# EasyEDA Pro project EasyEDApro.epro

# Schematic IR remote esp32
Create Date: 2024-05-21; Page Name: P1; Project Name: ROBONOMICS IR REMOTE DEV RELEASE; Schematic Name: ESP32-WROOM-32UE-N8; Update Date: 2024-05-21; Company: Robonomics.network; Drawn: ludovich88; Page Size: A4; Part Number: IR-ESP32-32UE; Reviewed: EnsRationis; Version: V2.1
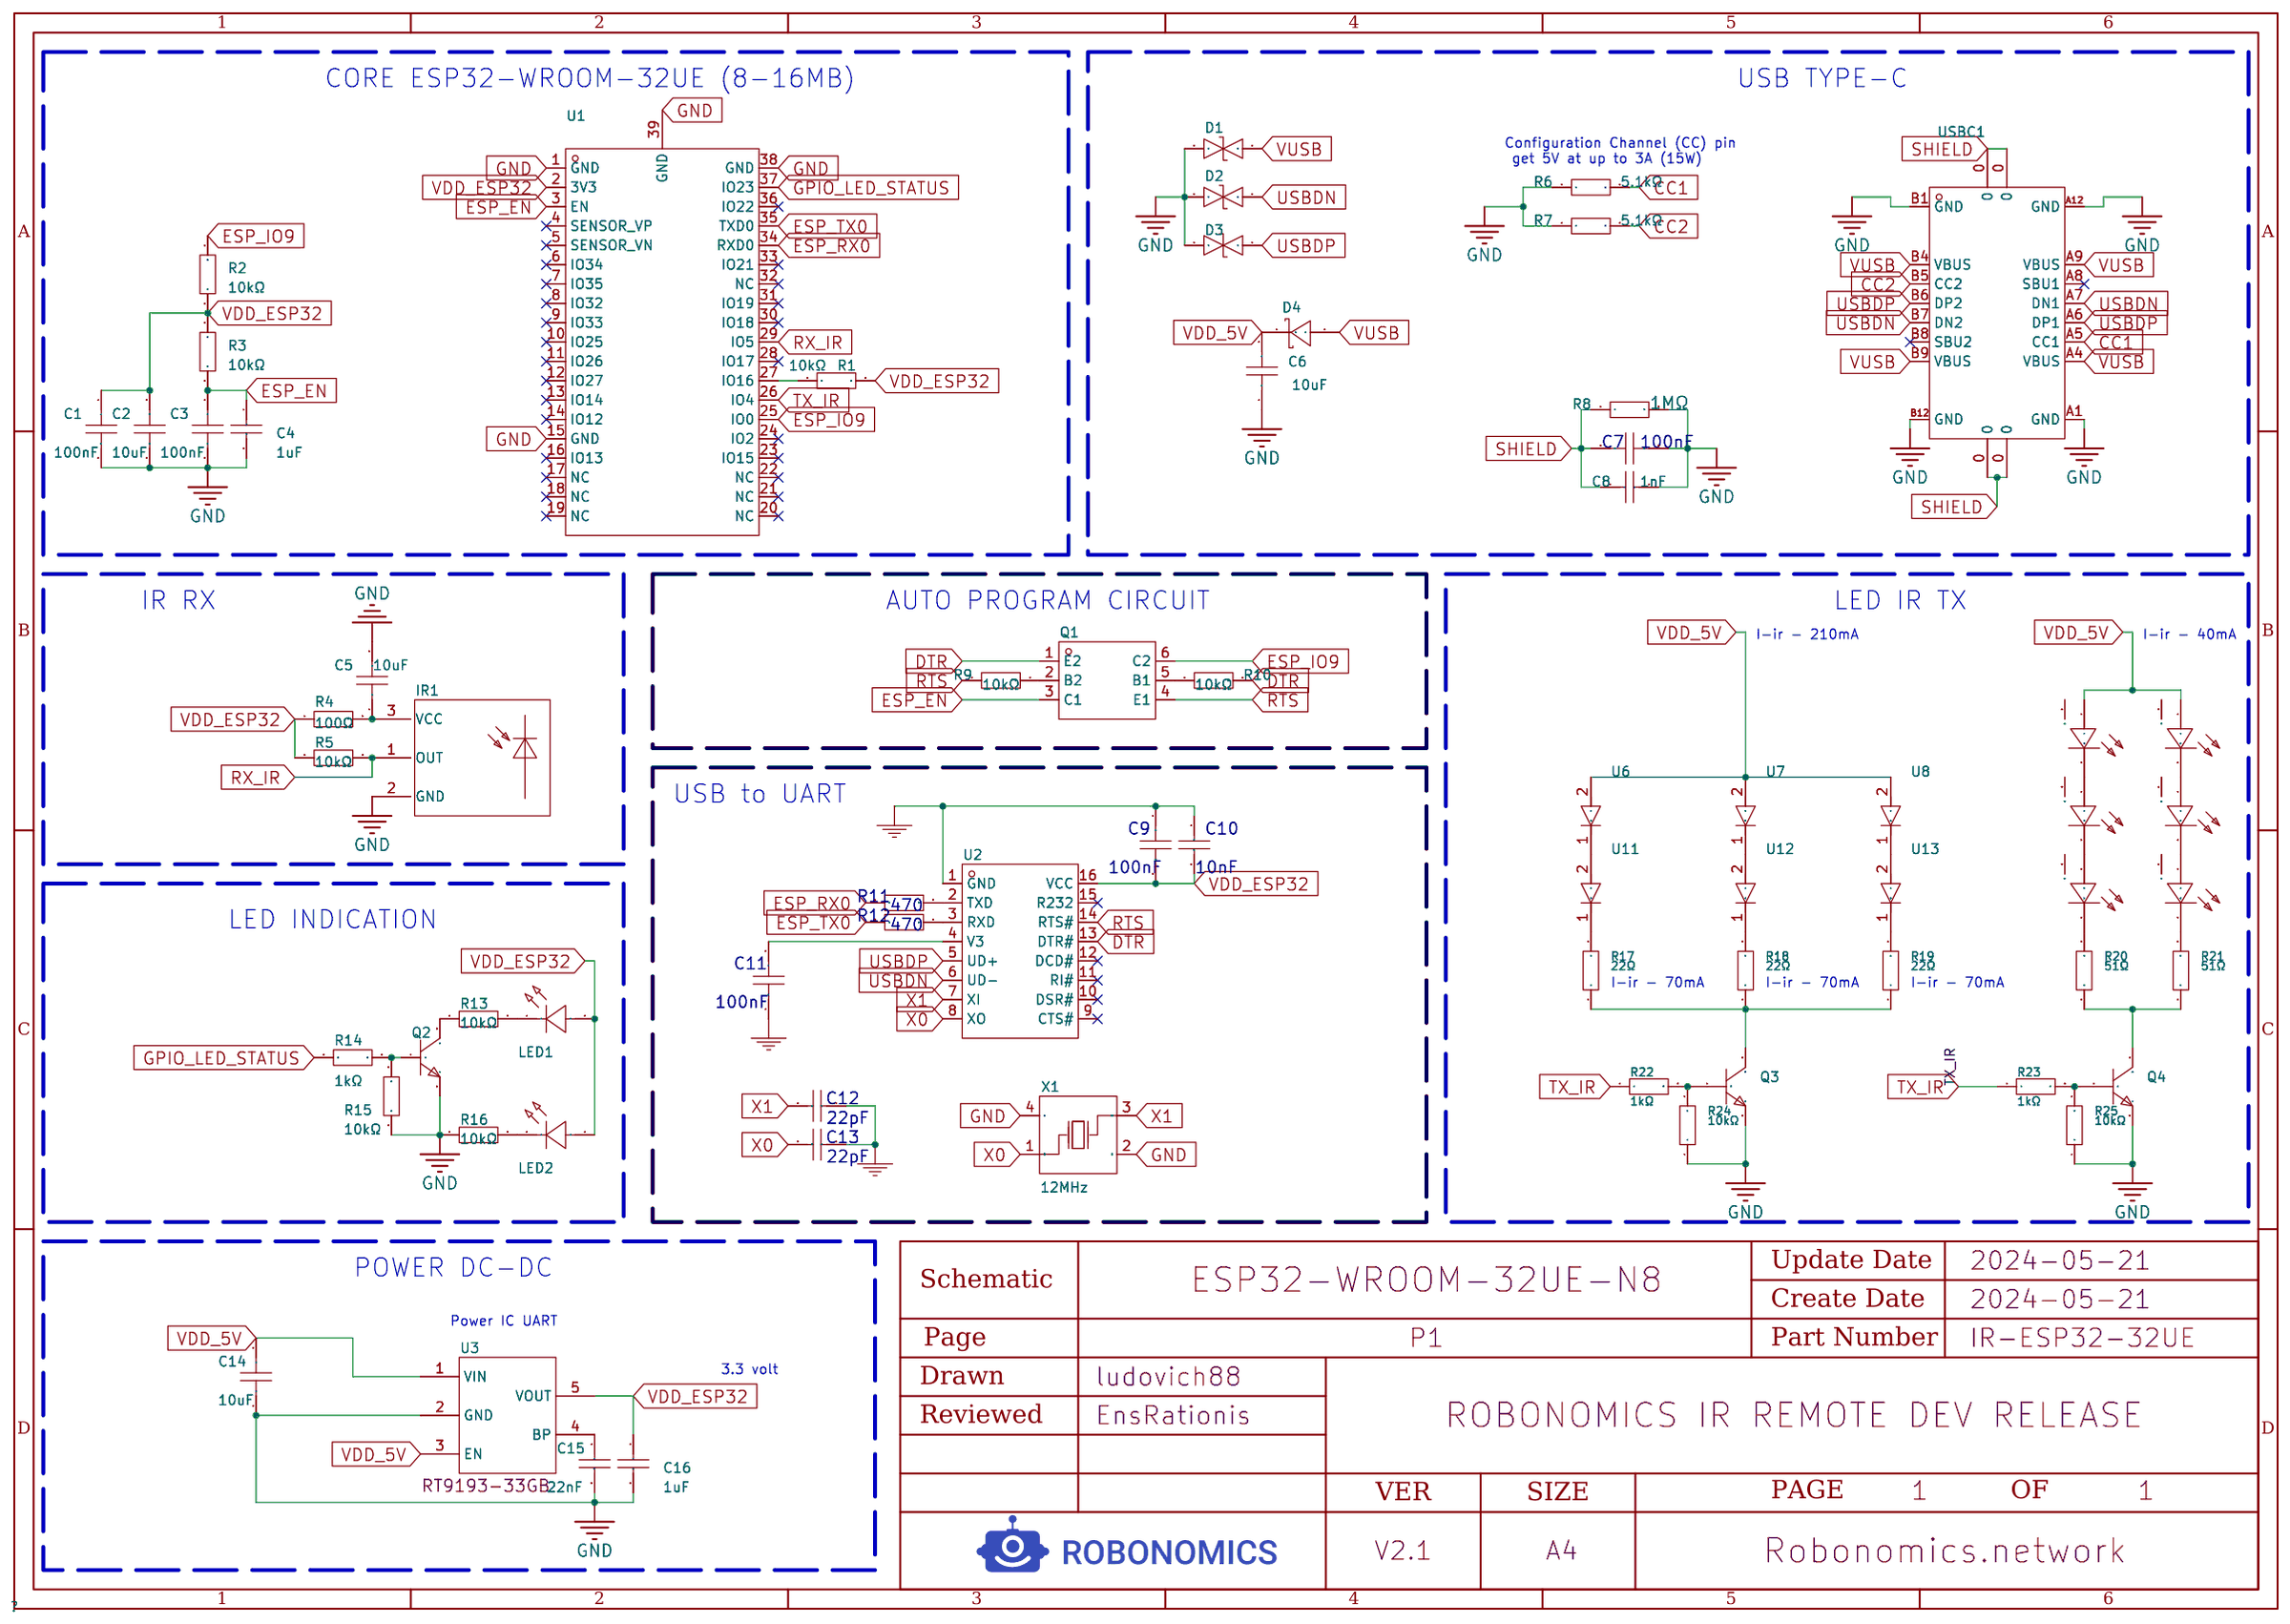
[diagram p0: schematic sheet]

## Parts
C1  100nF  [C0603]
C2  10uF  [C0603]
C3  100nF  [C0603]
C4  1uF  [C0603]
C5  10uF  [C0603]
C6  10uF  [C0603]
C7  100nF  [C0603]
C8  1nF  [C0603]
C9  100nF  [C0603]
C10  10nF  [C0603]
C11  100nF  [C0603]
C12  22pF  [C0603]
C13  22pF  [C0603]
C14  10uF  [C0603]
C15  22nF  [C0603]
C16  1uF  [C0603]
D1  -  [SOD-523_L1.2-W0.8-LS1.6-BI]
D2  -  [SOD-523_L1.2-W0.8-LS1.6-BI]
D3  -  [SOD-523_L1.2-W0.8-LS1.6-BI]
D4  -  [SOD-123_L2.7-W1.6-LS3.7-RD]
IR1  -  [OPTO-TH_IRM-56384]
LED1  XL-4008UGC  [LED-SMD_L4.0-W1.4-RD_GREEN]
LED2  XL-4008SURC  [LED-SMD_L4.0-W1.4-FD_my]
Q1  -  [SOT-363_L2.0-W1.3-P0.65-LS2.1-BR]
Q2  SS8050  [SOT-23-3_L2.9-W1.6-P1.90-LS2.8-BR]
Q3  -  [SOT-23-3_L2.9-W1.6-P1.90-LS2.8-BR]
Q4  -  [SOT-23-3_L2.9-W1.6-P1.90-LS2.8-BR]
R1  10kΩ  [R0603]
R2  10kΩ  [R0603]
R3  10kΩ  [R0603]
R4  100Ω  [R0603]
R5  10kΩ  [R0603]
R6  5.1kΩ  [R0603]
R7  5.1kΩ  [R0603]
R8  1MΩ  [R0603]
R9  10kΩ  [R0603]
R10  10kΩ  [R0603]
R11  470Ω  [R0603]
R12  470Ω  [R0603]
R13  10kΩ  [R0603]
R14  1kΩ  [R0603]
R15  10kΩ  [R0603]
R16  10kΩ  [R0603]
R17  22Ω  [R0603]
R18  22Ω  [R0603]
R19  22Ω  [R0603]
R20  51Ω  [R0603]
R21  51Ω  [R0603]
R22  1kΩ  [R0603]
R23  1kΩ  [R0603]
R24  10kΩ  [R0603]
R25  10kΩ  [R0603]
U1  -  [WIFI-SMD_ESP32-WROOM-32UE]
U2  -  [SOIC-16_L9.9-W3.9-P1.27-LS6.0-BL]
U3  -  [SOT-23-5_L3.0-W1.7-P0.95-LS2.8-BR]
U4  LKIR30102C-A01(XY)  [LED-SMD_EVERLIGHT_LKIR30102C-A01XY]
U5  LKIR30102C-A01(XY)  [LED-SMD_EVERLIGHT_LKIR30102C-A01XY]
U6  SFH 4253-Z  [OPTO-SMD_L3.2-W2.8-LS3.5-L-1]
U7  SFH 4253-Z  [OPTO-SMD_L3.2-W2.8-LS3.5-L-1]
U8  SFH 4253-Z  [OPTO-SMD_L3.2-W2.8-LS3.5-L-1]
U9  LKIR30102C-A01(XY)  [LED-SMD_EVERLIGHT_LKIR30102C-A01XY]
U10  LKIR30102C-A01(XY)  [LED-SMD_EVERLIGHT_LKIR30102C-A01XY]
U11  SFH 4253-Z  [OPTO-SMD_L3.2-W2.8-LS3.5-L-1]
U12  SFH 4253-Z  [OPTO-SMD_L3.2-W2.8-LS3.5-L-1]
U13  SFH 4253-Z  [OPTO-SMD_L3.2-W2.8-LS3.5-L-1]
U14  LKIR30102C-A01(XY)  [LED-SMD_EVERLIGHT_LKIR30102C-A01XY]
U15  LKIR30102C-A01(XY)  [LED-SMD_EVERLIGHT_LKIR30102C-A01XY]
USBC1  -  [USB-C_SMD-TYPE-C-31-M-12]
X1  12MHz  [OSC-SMD_4P-L3.2-W2.5-BL]

## Library data of the parts
C1 C3 = CC0603KRX7R9BB104: Capacitance: Tolerance:±10% Tolerance:±10% Voltage Rated: Temperature Coefficient:; LCSC Part Name: 100nF ±10% 50V; Supplier Part: C14663; Manufacturer: YAGEO(国巨); Supplier Footprint: 0603; JLCPCB Part Class: Basic Part; Datasheet: https://atta.szlcsc.com/upload/public/pdf/source/20180910/C282072_33301C7F631E79921B82A8DAC6BCC5B3.pdf; Supplier: LCSC; Tolerance: ±10%; Voltage Rated: 50V; Temperature Coefficient: Y5V
C2 C5 C14 = CL10A106KP8NNNC: Capacitance: Tolerance:±10% Tolerance:±10% Voltage Rated: Temperature Coefficient:; LCSC Part Name: 10uF ±10% 10V; Supplier Part: C19702; Manufacturer: SAMSUNG(三星); Supplier Footprint: 0603; JLCPCB Part Class: Basic Part; Datasheet: https://atta.szlcsc.com/upload/public/pdf/source/20160218/1457707763339.pdf; Supplier: LCSC; Tolerance: ±10%; Voltage Rated: 10V; Temperature Coefficient: X5R
C4 C16 = CL10A105KB8NNNC: Capacitance:1uFTolerance:±10%Tolerance:±10%VoltageRated:50VTemperatureCoefficient:X5R; LCSC Part Name: 1uF±10%50V; Supplier Part: C15849; Manufacturer: SAMSUNG(三星); Supplier Footprint: 0603; JLCPCB Part Class: BasicPart; Datasheet: https://atta.szlcsc.com/upload/public/pdf/source/20160103/1457707679084.pdf; Supplier: LCSC; Tolerance: ±10%; Voltage Rated: 50V; Temperature Coefficient: X5R
C6 = CL10A106KP8NNNC: Capacitance: Tolerance:±10% Tolerance:±10% Voltage Rated: Temperature Coefficient:; LCSC Part Name: 10uF ±10% 10V; Supplier Part: C19702; Manufacturer: SAMSUNG(三星); Supplier Footprint: 0603; JLCPCB Part Class: Basic Part; Datasheet: https://atta.szlcsc.com/upload/public/pdf/source/20160218/1457707763339.pdf; Supplier: LCSC; Tolerance: ±10%
C7 C9 C11 = CC0603KRX7R9BB104: Capacitance: Tolerance:±10% Tolerance:±10% Voltage Rated: Temperature Coefficient:; LCSC Part Name: 100nF ±10% 50V; Supplier Part: C14663; Manufacturer: YAGEO(国巨); Supplier Footprint: 0603; JLCPCB Part Class: Basic Part; Datasheet: https://atta.szlcsc.com/upload/public/pdf/source/20180910/C282072_33301C7F631E79921B82A8DAC6BCC5B3.pdf; Supplier: LCSC; Tolerance: ±10%
C8 = CL10B102KB8NNNC: Capacitance:1nFTolerance:±10%Tolerance:±10%VoltageRated:50VTemperatureCoefficient:X7R; LCSC Part Name: 1nF±10%50V; Supplier Part: C1588; Manufacturer: SAMSUNG(三星); Supplier Footprint: 0603; JLCPCB Part Class: BasicPart; Datasheet: https://atta.szlcsc.com/upload/public/pdf/source/20160103/1457707679526.pdf; Supplier: LCSC; Tolerance: ±10%; Voltage Rated: 50V; Temperature Coefficient: X7R
C10 = 0603B103K500NT: Supplier: LCSC; Manufacturer: FH; Supplier Part: C57112; JLCPCB Part Class: BasicPart
C12 C13 = CL10C220JB8NNNC: Supplier: LCSC; Manufacturer: SAMSUNG; Supplier Part: C1653; JLCPCB Part Class: BasicPart
C15 = CL10B223KB8NNNC: Capacitance:22nFTolerance:±10%Tolerance:±10%VoltageRated:50VTemperatureCoefficient:X7R; LCSC Part Name: 22nF±10%50V; Supplier Part: C21122; Manufacturer: SAMSUNG(三星); Supplier Footprint: 0603; JLCPCB Part Class: BasicPart; Datasheet: https://atta.szlcsc.com/upload/public/pdf/source/20160103/1457707705232.pdf; Supplier: LCSC; Tolerance: ±10%; Voltage Rated: 50V; Temperature Coefficient: X7R
D1-D3 = LESD5D5.0CT1G: Polarity:Bi-DirectionalReverseStand-OffVoltage(Vrwm):5VBreakdownVoltage(VBR):5.6VPeakPulseCurrent(Ipp)@8/20us:9.4AClampingVoltage@Ipp:18.6V; Supplier Part: C383211; Manufacturer: LRC(乐山无线电); Supplier Footprint: SOD-523; JLCPCB Part Class: ExtendedPart; Datasheet: https://atta.szlcsc.com/upload/public/pdf/source/20190807/C383211_633DF4B4E2C161403226E5235FE33A1C.pdf; Supplier: LCSC; Polarity: Bi-Directional; Reverse Stand-Off Voltage (Vrwm): 5V; Breakdown Voltage (VBR): 5.6V; Peak Pulse Current(Ipp)@8/20us: 9.4A; Clamping Voltage@Ipp: 18.6V
D4 = 1N5819HW-7-F: ReverseVoltage(Vr):40VAverageRectifiedCurrent(Io):1AForwardVoltage(Vf@If):450mV@1A; LCSC Part Name: 40V1A450mV@1A; Supplier Part: C82544; Manufacturer: DIODES(美台); Supplier Footprint: SOD-123; JLCPCB Part Class: ExtendedPart; Datasheet: https://atta.szlcsc.com/upload/public/pdf/source/20161024/1477288459223.pdf; Supplier: LCSC; Reverse Voltage (Vr): 40V; Average Rectified Current (Io): 1A; Forward Voltage (Vf@If): 450mV@1A
IR1 = IRM-56384: Supplier Part: C72048; Manufacturer: EVERLIGHT(亿光); Supplier Footprint: SIP-3-2.54mm; Datasheet: https://atta.szlcsc.com/upload/public/pdf/source/20160507/1462613614000.pdf; Supplier: LCSC
LED1 = XL-4008UGC: EmittedColor:EmeraldLensColor:ColorlesstransparenceDominantWavelength:520nm~525nmDominantWavelength:520nm~525nmPeakWavelength:525nmForwardCurrent:50mAPowerDissipation:125mWViewingAngle:120°MountingSytle:SidestickersOperatingTemperatur; LCSC Part Name: 侧贴; Supplier Part: C2843772; Manufacturer: XINGLIGHT(成兴光); Supplier Footprint: SMD,1.4x4mm; JLCPCB Part Class: ExtendedPart; Datasheet: https://atta.szlcsc.com/upload/public/pdf/source/20221102/5120FC94C7C2123DB0544AD5FB85956A.pdf; Supplier: LCSC; Emitted Color: Emerald; Lens Color: Colorlesstransparence; Dominant Wavelength: 520nm~525nm; Peak Wavelength: 525nm; Forward Current: 50mA; Power Dissipation: 125mW; Viewing Angle: 120°; Mounting Sytle: Sidestickers; Operating Temperature: -30℃~+85℃
LED2 = XL-4008SURC: EmittedColor:红灯LensColor:ColorlesstransparenceDominantWavelength:620nm~625nmDominantWavelength:620nm~625nmPeakWavelength:625nmForwardCurrent:50mAPowerDissipation:125mWViewingAngle:120°MountingSytle:SidestickersOperatingTemperature:-30; LCSC Part Name: 红灯侧贴; Supplier Part: C2843771; Manufacturer: XINGLIGHT(成兴光); Supplier Footprint: SMD,1.4x4mm; JLCPCB Part Class: ExtendedPart; Datasheet: https://atta.szlcsc.com/upload/public/pdf/source/20221102/EAC0B38F8924C881A99BE374D0B10640.pdf; Supplier: LCSC; Emitted Color: 红灯; Lens Color: Colorlesstransparence; Dominant Wavelength: 620nm~625nm; Peak Wavelength: 625nm; Forward Current: 50mA; Power Dissipation: 125mW; Viewing Angle: 120°; Mounting Sytle: Sidestickers; Operating Temperature: -30℃~+85℃
Q1 = LBC847BDW1T1G: TransistorType:2NPNCollector-EmitterBreakdownVoltage(Vceo):CollectorCurrent(Ic):PowerDissipation(Pd):CollectorCut-OffCurrent(Icbo):15nACollector-EmitterSaturationVoltage(VCE(sat)@Ic,Ib):600mV@100mA,5mADCCurrentGain(hFE@Ic,Vce):180@; LCSC Part Name: 2个NPN45V100mA; Supplier Part: C383191; Manufacturer: LRC(乐山无线电); Supplier Footprint: SC-88; Datasheet: https://atta.szlcsc.com/upload/public/pdf/source/20190725/C383191_905ABB7983ACCB470816CB967A06AF18.pdf; Supplier: LCSC; Transistor Type: 2NPN; Collector Cut-Off Current (Icbo): 15nA; Collector-Emitter Saturation Voltage (VCE(sat)@Ic,Ib): 600mV@100mA,5mA; DC Current Gain (hFE@Ic,Vce): 180@2mA,5V; Transition Frequency (fT): 100MHz; Operating Temperature: -55℃~+150℃@(Tj)
Q2 = SS8050_C181160: TransistorType:Collector-EmitterBreakdownVoltage(Vceo):CollectorCurrent(Ic):PowerDissipation(Pd):CollectorCut-OffCurrent(Icbo):100nACollector-EmitterSaturationVoltage(VCE(sat)@Ic,Ib):500mV@800mA,80mADCCurrentGain(hFE@Ic,Vce):200@100; LCSC Part Name: NPN25V1.5AH档（200-350）; Supplier Part: C181160; Manufacturer: Hottech(合科泰); Supplier Footprint: SOT-23; JLCPCB Part Class: ExtendedPart; Datasheet: https://atta.szlcsc.com/upload/public/pdf/source/20220506/87BBA77FEE9CB4B19031AE933C67329E.pdf; Supplier: LCSC; Collector Cut-Off Current (Icbo): 100nA; Collector-Emitter Saturation Voltage (VCE(sat)@Ic,Ib): 500mV@800mA,80mA; DC Current Gain (hFE@Ic,Vce): 200@100mA,1V; Transition Frequency (fT): 100MHz; Operating Temperature: +150℃@(Tj)
Q3 Q4 = SS8050_C177739: TransistorType:Collector-EmitterBreakdownVoltage(Vceo):CollectorCurrent(Ic):PowerDissipation(Pd):CollectorCut-OffCurrent(Icbo):100nACollector-EmitterSaturationVoltage(VCE(sat)@Ic,Ib):500mV@800mA,80mADCCurrentGain(hFE@Ic,Vce):300@100; LCSC Part Name: NPN25V1.5AJ档300-400; Supplier Part: C177739; Manufacturer: CJ(江苏长电/长晶); Manufacturer Part: SS8050; Supplier Footprint: SOT-23; Datasheet: https://atta.szlcsc.com/upload/public/pdf/source/20180130/C177739_15172974524031323483.pdf; Supplier: LCSC; Collector Cut-Off Current (Icbo): 100nA; Collector-Emitter Saturation Voltage (VCE(sat)@Ic,Ib): 500mV@800mA,80mA; DC Current Gain (hFE@Ic,Vce): 300@100mA,1V; Transition Frequency (fT): 100MHz; Operating Temperature: +150℃@(Tj)
R1-R3 R5 R9 R10 R13 R15 R16 = 0603WAF1002T5E: Type:Thick Film Resistors Resistance:10000Ω Tolerance:±1% Tolerance:±1% Power(Watts): Overload Voltage (Max): Temperature Coefficient:±100ppm/℃ Temperature Coefficient:±100ppm/℃ Operating Temperature Range:-55℃~+155℃ Operating Temperature Range:-55℃~+155℃; LCSC Part Name: 10kΩ ±1% 100mW 厚膜电阻; Supplier Part: C25804; Manufacturer: UNI-ROYAL(厚声); Supplier Footprint: 0603; JLCPCB Part Class: Basic Part; Datasheet: https://atta.szlcsc.com/upload/public/pdf/source/20200306/C422600_1E6D84923E4A46A82E41ADD87F860B5C.pdf; Supplier: LCSC; Tolerance: ±1%; Power(Watts): 1/10W; Overload Voltage (Max): 75V; Temperature Coefficient: ±100ppm/℃; Type: Thick Film Resistors; Operating Temperature Range: -55℃~+155℃
R4 = 0603WAF1000T5E: Type:ThickFilmResistorsResistance:Tolerance:±1%Tolerance:±1%Power(Watts):TemperatureCoefficient:±200ppm/℃TemperatureCoefficient:±200ppm/℃OverloadVoltage(Max):OperatingTemperatureRange:-55℃~+155℃OperatingTemperatureRange:-55℃~+155℃; LCSC Part Name: 100Ω±1%100mW; Supplier Part: C22775; Manufacturer: UNI-ROYAL(厚声); Supplier Footprint: 0603; JLCPCB Part Class: BasicPart; Datasheet: https://atta.szlcsc.com/upload/public/pdf/source/20200306/C422600_1E6D84923E4A46A82E41ADD87F860B5C.pdf; Supplier: LCSC; Type: ThickFilmResistors; Tolerance: ±1%; Temperature Coefficient: ±200ppm/℃; Operating Temperature Range: -55℃~+155℃
R6 R7 = 0603WAF5101T5E: Type:厚膜电阻 Resistance:5.1kΩ Tolerance:±1% Power(Watts):1/10W Temperature Coefficient:±100ppm/ Temperature Coefficient:±100ppm/ Overload Voltage (Max):75V Operating Temperature Range:-55~+155 Operating Temperature Range:-55~+155; LCSC Part Name: 5.1kΩ±1%; Supplier Part: C23186; Manufacturer: UNI-ROYAL(厚声); Supplier Footprint: 0603; JLCPCB Part Class: BasicPart; Datasheet: https://atta.szlcsc.com/upload/public/pdf/source/20200306/C422600_1E6D84923E4A46A82E41ADD87F860B5C.pdf; Supplier: LCSC; Type: 厚膜电阻; Tolerance: ±1%; Power(Watts): 1/10W; Temperature Coefficient: ±100ppm/; Overload Voltage (Max): 75V; Operating Temperature Range: -55~+155
R8 = 0603WAF1004T5E: LCSC Part Name: 1MΩ(1004)±1%编带; Supplier Part: C22935; Manufacturer: UNI-ROYAL(厚声); Supplier Footprint: 0603; JLCPCB Part Class: BasicPart; Datasheet: https://atta.szlcsc.com/upload/public/pdf/source/20170920/C22935_1505900992858982324.pdf; Supplier: LCSC
R11 R12 = 0603WAF4700T5E: Supplier: LCSC; Manufacturer: UniOhm; Supplier Part: C23179; JLCPCB Part Class: BasicPart
R14 = RC0603FR-071KL: Resistance:Tolerance:±1%Tolerance:±1%Power(Watts):TemperatureCoefficient:±100ppm/℃TemperatureCoefficient:±100ppm/℃OverloadVoltage(Max):OperatingTemperatureRange:-55℃~+155℃OperatingTemperatureRange:-55℃~+155℃; LCSC Part Name: 1kΩ±1%100mW; Supplier Part: C22548; Manufacturer: YAGEO(国巨); Supplier Footprint: 0603; JLCPCB Part Class: ExtendedPart; Datasheet: https://atta.szlcsc.com/upload/public/pdf/source/20180312/7BD3618A8B6324EA6280B0497A051AB7.pdf; Supplier: LCSC; Tolerance: ±1%; Temperature Coefficient: ±100ppm/℃; Operating Temperature Range: -55℃~+155℃
R17-R19 = 0603WAF220JT5E: Type:Thick Film Resistors Resistance:22Ω Tolerance:±1% Tolerance:±1% Power(Watts): Overload Voltage (Max): Temperature Coefficient:±100ppm/℃ Temperature Coefficient:±100ppm/℃ Operating Temperature Range:-55℃~+155℃ Operating Temperature Range:-55℃~+155℃; LCSC Part Name: 22Ω ±1% 100mW 厚膜电阻; Supplier Part: C23345; Manufacturer: UNI-ROYAL(厚声); Supplier Footprint: 0603; JLCPCB Part Class: Basic Part; Datasheet: https://atta.szlcsc.com/upload/public/pdf/source/20200306/C422600_1E6D84923E4A46A82E41ADD87F860B5C.pdf; Supplier: LCSC; Type: Thick Film Resistors; Tolerance: ±1%; Temperature Coefficient: ±100ppm/℃; Operating Temperature Range: -55℃~+155℃
R20 R21 = 0603WAF510JT5E: Resistance:51000mΩ Tolerance:±1% Tolerance:±1% Power(Watts): Overload Voltage (Max): Temperature Coefficient:±100ppm/℃ Temperature Coefficient:±100ppm/℃ Type:Thick Film Resistors Operating Temperature Range:-55℃~+155℃ Operating Temperature Range:-55℃~+155; LCSC Part Name: 51Ω ±1% 100mW 厚膜电阻; Supplier Part: C23197; Manufacturer: UNI-ROYAL(厚声); Supplier Footprint: 0603; JLCPCB Part Class: Basic Part; Datasheet: https://atta.szlcsc.com/upload/public/pdf/source/20200306/C422600_1E6D84923E4A46A82E41ADD87F860B5C.pdf; Supplier: LCSC; Tolerance: ±1%; Temperature Coefficient: ±100ppm/℃; Type: Thick Film Resistors; Operating Temperature Range: -55℃~+155℃
R22 R23 = 0603WAF1001T5E: Type:Thick Film Resistors Resistance: Tolerance:±1% Tolerance:±1% Power(Watts): Temperature Coefficient:±100ppm/℃ Temperature Coefficient:±100ppm/℃ Overload Voltage (Max): Operating Temperature Range:-55℃~+155℃ Operating Temperature Range:-55℃~+155℃; LCSC Part Name: 厚膜电阻 1kΩ ±1% 100mW; Supplier Part: C21190; Manufacturer: UNI-ROYAL(厚声); Supplier Footprint: 0603; JLCPCB Part Class: Basic Part; Datasheet: https://atta.szlcsc.com/upload/public/pdf/source/20200306/C422600_1E6D84923E4A46A82E41ADD87F860B5C.pdf; Supplier: LCSC; Type: Thick Film Resistors; Tolerance: ±1%; Temperature Coefficient: ±100ppm/℃; Operating Temperature Range: -55℃~+155℃
R24 R25 = 0603WAF1002T5E: Type:Thick Film Resistors Resistance:10000Ω Tolerance:±1% Tolerance:±1% Power(Watts): Overload Voltage (Max): Temperature Coefficient:±100ppm/℃ Temperature Coefficient:±100ppm/℃ Operating Temperature Range:-55℃~+155℃ Operating Temperature Range:-55℃~+155℃; LCSC Part Name: 10kΩ ±1% 100mW 厚膜电阻; Supplier Part: C25804; Manufacturer: UNI-ROYAL(厚声); Supplier Footprint: 0603; JLCPCB Part Class: Basic Part; Datasheet: https://atta.szlcsc.com/upload/public/pdf/source/20200306/C422600_1E6D84923E4A46A82E41ADD87F860B5C.pdf; Supplier: LCSC; Tolerance: ±1%; Temperature Coefficient: ±100ppm/℃; Type: Thick Film Resistors; Operating Temperature Range: -55℃~+155℃
U1 = ESP32-WROOM-32UE-N8: LCSC Part Name: WIFI模块; Supplier Part: C701345; Manufacturer: ESPRESSIF(乐鑫); Supplier Footprint: SDM-38(18x19.2x3.2); JLCPCB Part Class: ExtendedPart; Datasheet: https://atta.szlcsc.com/upload/public/pdf/source/20200730/C701341_95E089979D39CD8D2471FDC7C7AF29A1.pdf; Supplier: LCSC
U2 = CH340G: Type:TransceiverProtocol:USB2.0NumberofDrivers/Receivers:-DataRate:2MbpsSupplyVoltage:3.3V,5V; Supplier Part: C14267; Manufacturer: WCH(南京沁恒); Supplier Footprint: SOP-16_150mil; JLCPCB Part Class: ExtendedPart; Datasheet: https://atta.szlcsc.com/upload/public/pdf/source/20200819/C14267_9F0B4B8160AEBA86F3219E64956E4601.pdf; Supplier: LCSC; Type: Transceiver; Protocol: USB2.0; Data Rate: 2Mbps; Supply Voltage: 3.3V,5V
U3 = RT9193-33GB: OutputType:固定OutputPolarity:正NumberofOutputs:1MaximumInputVoltage:5.5VOutputVoltage:3.3VOutputVoltage:3.3VDropoutVoltage:300mV@(300mA)OutputCurrent:300mAPowerSupplyRejectionRatio(PRSS):70dB@(100Hz),50dB@(10kHz); LCSC Part Name: Vin=5.5VVout=3.3V300mA70dB@(100Hz),50dB@(10kHz); Supplier Part: C15651; Manufacturer: RICHTEK(台湾立锜); Supplier Footprint: SOT-23-5; JLCPCB Part Class: ExtendedPart; Datasheet: https://atta.szlcsc.com/upload/public/pdf/source/20130730/1457706628575.pdf; Supplier: LCSC; Output Type: 固定; Output Polarity: 正; Number of Outputs: 1; Maximum Input Voltage: 5.5V; Output Voltage: 3.3V; Dropout Voltage: 300mV@(300mA); Output Current: 300mA; Power Supply Rejection Ratio (PRSS): 70dB@(100Hz),50dB@(10kHz)
U4 U5 U9 U10 U14 U15 = LKIR30102C-A01(XY): Supplier Part: C2874187; Manufacturer: EVERLIGHT(亿光); Supplier Footprint: SMD-3P,2x3mm; JLCPCB Part Class: Extended Part; Datasheet: https://atta.szlcsc.com/upload/public/pdf/source/20210803/C2874187_E8BC3F3987A1EDC6242A0C232E3AD98B.pdf; Supplier: LCSC
U6-U8 U11-U13 = SFH 4253-Z: Vf - Forward Voltage:1.6V Vf - Forward Voltage:1.6V Wavelength:860nm Wavelength:860nm Radiant Intensity:6.3mW/sr@70mA View Angle:120° Operating Temperature:-40℃~+100℃ Operating Temperature:-40℃~+100℃; LCSC Part Name: 光电二极管; Supplier Part: C2900339; Manufacturer: OSRAM(欧司朗); Supplier Footprint: SMD; JLCPCB Part Class: Extended Part; Datasheet: https://atta.szlcsc.com/upload/public/pdf/source/20210702/C2765347_A31CFC617678E8698ED6795D9701EB7D.pdf; Supplier: LCSC; Vf - Forward Voltage: 1.6V; Wavelength: 860nm; Radiant Intensity: 6.3mW/sr@70mA; View Angle: 120°; Operating Temperature: -40℃~+100℃
USBC1 = TYPE-C-31-M-12: ConnectorType:Type-CStandard:-Gender:母座NumberofContacts:16NumberofPorts:1CurrentRating-Power(Max):250mA; Supplier Part: C165948; Manufacturer: 韩国韩荣; JLCPCB Part Class: ExtendedPart; Datasheet: https://atta.szlcsc.com/upload/public/pdf/source/20210111/C2682493_D8CCFED08835E878D16ACCF4460E43B8.pdf; Supplier: LCSC; Connector Type: Type-C; Gender: 母座; Number of Contacts: 16; Number of Ports: 1; Current Rating - Power (Max): 250mA
X1 = X322512MSB4SI: Crystal Type:贴片无源晶振 Frequency:12MHz Frequency Tolerance:±10ppm Frequency Tolerance:±10ppm Frequency Stability:±30ppm Frequency Stability:±30ppm Load Capacitance:20pF Operating Temperature:-40~+85 Operating Temperature:-40~+85; LCSC Part Name: 12MHz±10ppm20pF; Supplier Part: C9002; Manufacturer: YXC扬兴科技; Supplier Footprint: SMD3225-4P; JLCPCB Part Class: BasicPart; Datasheet: https://atta.szlcsc.com/upload/public/pdf/source/20210329/C112971_1F611BDC486E193C1706F6D8EB5AA189.pdf; Supplier: LCSC; Crystal Type: 贴片无源晶振; Frequency Tolerance: ±10ppm; Frequency Stability: ±30ppm; Load Capacitance: 20pF; Operating Temperature: -40~+85

## Nets
GND: C1.2 C2.1 C3.2 C4.2 C5.2 C6.1 C7.1 C8.2 C9.1 C10.1 C11.1 C12.1 C13.1 C14.1 C15.2 C16.2 D1.2 D2.2 D3.2 IR1.2(GND) Q2.2(E) Q3.2(E) Q4.2(E) R6.1 R7.1 R8.2 R15.1 R16.1 R24.1 R25.1 U1.1(GND) U1.15(GND) U1.38(GND) U1.39(GND) U2.1(GND) U3.2(GND) USBC1.A1(GND) USBC1.A12(GND) USBC1.B1(GND) USBC1.B12(GND) X1.2(GND) X1.4(GND)
VDD_5V: C6.2 C14.2 D4.1(K) U3.1(VIN) U3.3(EN) U4.1(A) U5.1(A) U6.2(A) U7.2(A) U8.2(A)
VDD_ESP32: C1.1 C2.2 C9.2 C10.2 C16.1 LED1.2(A) LED2.1(A) R1.2 R2.2 R3.1 R4.1 R5.1 U1.2(3V3) U2.16(VCC) U3.5(VOUT)
CC1: R6.2 USBC1.A5(CC1)
CC2: R7.2 USBC1.B5(CC2)
DTR: Q1.1(E2) R10.2 U2.13(DTR#)
ESP_EN: C3.1 C4.1 Q1.3(C1) R3.2 U1.3(EN)
ESP_IO9: Q1.6(C2) R2.1 U1.25(IO0)
ESP_RX0: R11.1 U1.34(RXD0)
ESP_TX0: R12.1 U1.35(TXD0)
GPIO_LED_STATUS: R14.1 U1.37(IO23)
RTS: Q1.4(E1) R9.1 U2.14(RTS#)
RX_IR: IR1.1(OUT) R5.2 U1.29(IO5)
SHIELD: C7.2 C8.1 R8.1 USBC1.0
TX_IR: R22.1 R23.1 U1.26(IO4)
USBDN: D2.1 U2.6(UD-) USBC1.A7(DN1) USBC1.B7(DN2)
USBDP: D3.1 U2.5(UD+) USBC1.A6(DP1) USBC1.B6(DP2)
VUSB: D1.1 D4.2(A) USBC1.A4(VBUS) USBC1.A9(VBUS) USBC1.B4(VBUS) USBC1.B9(VBUS)
X0: C13.2 U2.8(XO) X1.1(OSC1)
X1: C12.2 U2.7(XI) X1.3(OSC2)
$1N8418: Q1.2(B2) R9.2
$1N8579: Q1.5(B1) R10.1
$1N9802: C15.1 U3.4(BP)
$1N16651: R1.1 U1.27(IO16)
$1N25941: C11.2 U2.4(V3)
$1N27717: C5.1 IR1.3(VCC) R4.2
$1N35621: R11.2 U2.2(TXD)
$1N35623: R12.2 U2.3(RXD)
$1N37592: Q4.1(B) R23.2 R25.2
$1N42833: Q3.1(B) R22.2 R24.2
$1N46226: Q4.3(C) R20.1 R21.1
$1N46382: Q3.3(C) R17.1 R18.1 R19.1
$1N46399: U10.2(C) U15.1(A)
$1N46407: R21.2 U15.2(C)
$1N46409: U5.2(C) U10.1(A)
$1N46420: U9.2(C) U14.1(A)
$1N46422: R20.2 U14.2(C)
$1N46424: U4.2(C) U9.1(A)
$1N61932: U6.1(C) U11.2(A)
$1N62062: U7.1(C) U12.2(A)
$1N62136: U8.1(C) U13.2(A)
$1N62310: R18.2 U12.1(C)
$1N62317: R19.2 U13.1(C)
$1N64118: R17.2 U11.1(C)
$1N66097: Q2.1(B) R14.2 R15.2
$1N66164: LED2.2(K) R16.2
$1N66203: Q2.3(C) R13.1
$1N66205: LED1.1(K) R13.2

Not connected (* = marked no-connect by the designer): U1 4(SENSOR_VP)* 5(SENSOR_VN)* 6(IO34)* 7(IO35)* 8(IO32)* 9(IO33)* 10(IO25)* 11(IO26)* 12(IO27)* 13(IO14)* 14(IO12)* 16(IO13)* 17(NC)* 18(NC)* 19(NC)* 20(NC)* 21(NC)* 22(NC)* 23(IO15)* 24(IO2)* 28(IO17)* 30(IO18)* 31(IO19)* 32(NC)* 33(IO21)* 36(IO22)*; U2 9(CTS#)* 10(DSR#)* 11(RI#)* 12(DCD#)* 15(R232)*; U4 3; U5 3; U9 3; U10 3; U14 3; U15 3; USBC1 A8(SBU1)* B8(SBU2)*

## Notes on the sheet
- CORE ESP32-WROOM-32UE (8-16MB)
- USB TYPE-C
- Configuration Channel (CC) pin
   get 5V at up to 3A (15W)
- IR RX
- AUTO PROGRAM CIRCUIT
- LED IR TX
- I-ir - 210mA
- I-ir - 40mA
- USB to UART
- LED INDICATION
- I-ir - 70mA
- I-ir - 70mA
- I-ir - 70mA
- POWER DC-DC
- Power IC UART
- 3.3 volt

# Board IR remote esp32
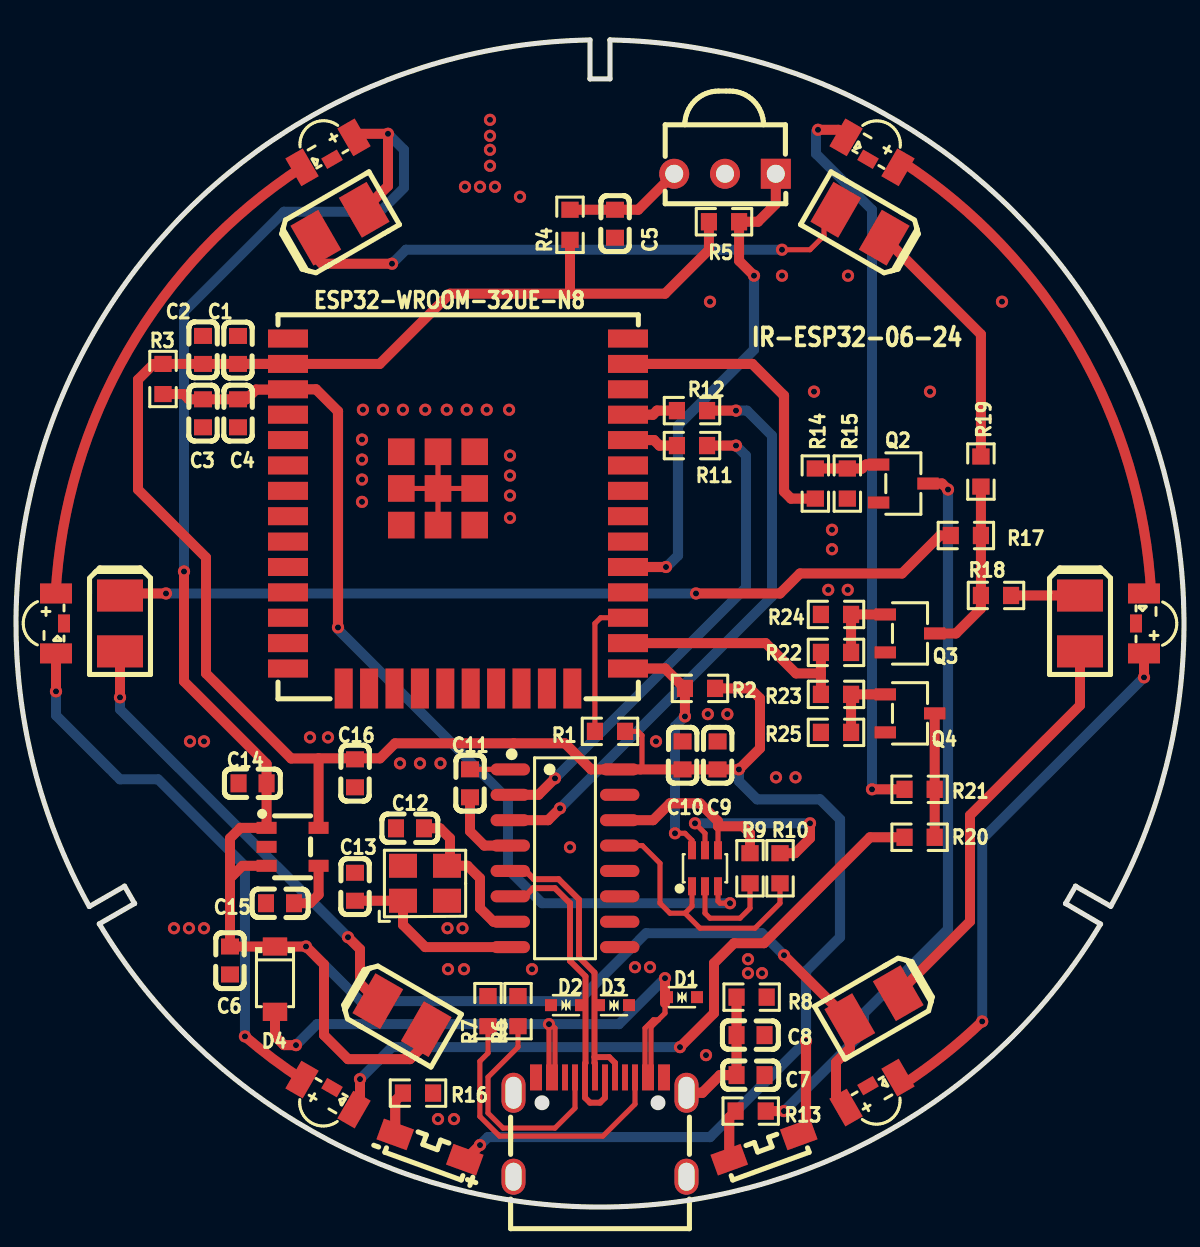
[diagram p1: board, top side]
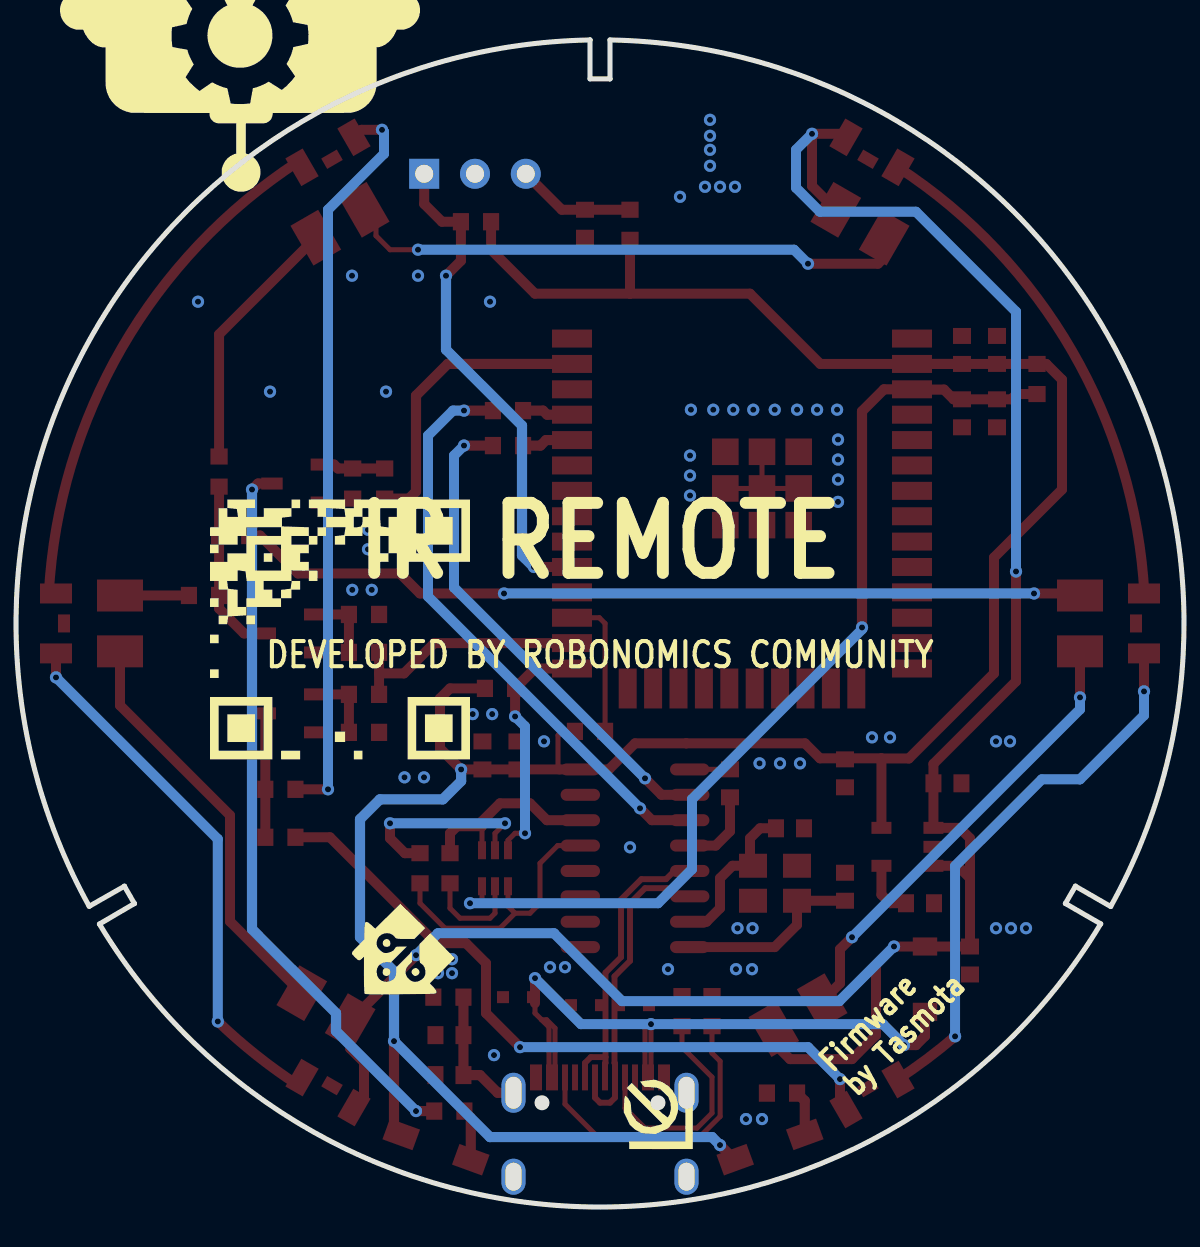
[diagram p2: board, bottom side, seen from below]

Outline 58.4 x 58.4 mm; copper layers: Top Layer, Bottom Layer. Coordinates in mm from the lower left corner of the outline.
Outline path: 3.67,15.04 5.43,16.05 5.93,15.19 4.17,14.17 arc(29.2,0) 54.23,14.16 52.48,15.18 52.48,15.18 52.98,16.05 54.74,15.05 arc(54.49,43.81) 29.7,58.4 29.7,56.45 28.7,56.45 28.71,56.45 28.71,58.4 arc(3.92,43.8) 3.67,15.04
Stack: Top Layer 0.035mm / Dielectric1 1.51mm FR4 er 4.5 / Bottom Layer 0.035mm

## Design rules (mm)
net USBDP: DP1
net USBDN: DP1
template: User Custom Config
spacing safeClearance (default): track to track 0.152, other pairs 0.152 to 0.3
track width trackWidth (default): min 0.127, default 0.254, max 2.54
differential pair differentialPair (default): width min 0.127, default 0.254, max 2.54; gap min 0.152, default 0.152
differential pair jlcpcb_2l_z90_copl: width min 0.254, default 0.297, max 2.54; gap min 0.152, default 0.152
via viaSize (default): diameter min 0.5, default 0.61, max 10; hole min 0.3, default 0.305, max 5.999
net GND uses copperRegion_USB
net USBDP uses copperRegion_USB, jlcpcb_2l_z90_copl
net USBDN uses copperRegion_USB, jlcpcb_2l_z90_copl
diff pair DP1 uses jlcpcb_2l_z90_copl

## Placement (name value [footprint] x y rotation side)
C1  100nF  [C0603]  11.11 42.89 90 top
C2  10uF  [C0603]  9.36 42.89 270 top
C3  100nF  [C0603]  9.36 39.72 270 top
C4  1uF  [C0603]  11.11 39.72 270 top
C5  10uF  [C0603]  29.95 49.2 270 top
C6  10uF  [C0603]  10.7 12.34 90 top
C7  100nF  [C0603]  36.73 6.6 180 top
C8  1nF  [C0603]  36.73 8.6 0 top
C9  100nF  [C0603]  35.08 22.6 270 top
C10  10nF  [C0603]  33.33 22.6 270 top
C11  100nF  [C0603]  22.7 21.2 270 top
C12  22pF  [C0603]  19.7 18.95 0 top
C13  22pF  [C0603]  16.95 16.03 270 top
C14  10uF  [C0603]  11.83 21.2 0 top
C15  22nF  [C0603]  13.2 15.2 180 top
C16  1uF  [C0603]  16.95 21.7 270 top
D1  -  [SOD-523_L1.2-W0.8-LS1.6-BI]  33.3 10.5 0 top
D2  -  [SOD-523_L1.2-W0.8-LS1.6-BI]  27.51 10.1 180 top
D3  -  [SOD-523_L1.2-W0.8-LS1.6-BI]  29.9 10.1 0 top
D4  -  [SOD-123_L2.7-W1.6-LS3.7-RD]  12.95 11.4 270 top
IR1  -  [OPTO-TH_IRM-56384]  35.45 51.7 180 top
LED1  XL-4008UGC  [LED-SMD_L4.0-W1.4-RD_GREEN]  37.4 3 20 top
LED2  XL-4008SURC  [LED-SMD_L4.0-W1.4-FD_my]  20.7 3 160 top
Q1  -  [SOT-363_L2.0-W1.3-P0.65-LS2.1-BR]  34.45 16.95 270 top
Q2  SS8050  [SOT-23-3_L2.9-W1.6-P1.90-LS2.8-BR]  44.37 36.2 180 top
Q3  -  [SOT-23-3_L2.9-W1.6-P1.90-LS2.8-BR]  44.7 28.7 180 top
Q4  -  [SOT-23-3_L2.9-W1.6-P1.90-LS2.8-BR]  44.7 24.7 180 top
R1  10kΩ  [R0603]  29.7 23.8 0 top
R2  10kΩ  [R0603]  34.2 25.95 0 top
R3  10kΩ  [R0603]  7.36 41.43 270 top
R4  100Ω  [R0603]  27.7 49.15 90 top
R5  10kΩ  [R0603]  35.4 49.3 0 top
R6  5.1kΩ  [R0603]  25.11 9.8 270 top
R7  5.1kΩ  [R0603]  23.61 9.8 270 top
R8  1MΩ  [R0603]  36.79 10.5 0 top
R9  10kΩ  [R0603]  36.7 16.95 270 top
R10  10kΩ  [R0603]  38.2 16.95 270 top
R11  470Ω  [R0603]  33.8 38.1 0 top
R12  470Ω  [R0603]  33.8 39.85 0 top
R13  10kΩ  [R0603]  36.74 4.8 180 top
R14  1kΩ  [R0603]  39.97 36.2 90 top
R15  10kΩ  [R0603]  41.57 36.2 90 top
R16  10kΩ  [R0603]  20.11 5.7 180 top
R17  22Ω  [R0603]  47.5 33.6 180 top
R18  22Ω  [R0603]  49.01 30.6 0 top
R19  22Ω  [R0603]  48.25 36.8 90 top
R20  51Ω  [R0603]  45.19 18.5 180 top
R21  51Ω  [R0603]  45.19 20.9 180 top
R22  1kΩ  [R0603]  41.01 27.75 0 top
R23  1kΩ  [R0603]  41.01 25.65 0 top
R24  10kΩ  [R0603]  41.01 29.65 0 top
R25  10kΩ  [R0603]  41.01 23.75 0 top
U1  -  [WIFI-SMD_ESP32-WROOM-32UE]  22.11 34.7 0 top
U2  -  [SOIC-16_L9.9-W3.9-P1.27-LS6.0-BL]  27.45 17.45 270 top
U3  -  [SOT-23-5_L3.0-W1.7-P0.95-LS2.8-BR]  13.83 18.02 180 top
U4  LKIR30102C-A01(XY)  [LED-SMD_EVERLIGHT_LKIR30102C-A01XY]  15.7 52.6 30 top
U5  LKIR30102C-A01(XY)  [LED-SMD_EVERLIGHT_LKIR30102C-A01XY]  42.7 5.9 210 top
U6  SFH 4253-Z  [OPTO-SMD_L3.2-W2.8-LS3.5-L-1]  19.3 9.6 330 top
U7  SFH 4253-Z  [OPTO-SMD_L3.2-W2.8-LS3.5-L-1]  42.9 10 210 top
U8  SFH 4253-Z  [OPTO-SMD_L3.2-W2.8-LS3.5-L-1]  16.2 49.2 30 top
U9  LKIR30102C-A01(XY)  [LED-SMD_EVERLIGHT_LKIR30102C-A01XY]  2.2 29.2 90 top
U10  LKIR30102C-A01(XY)  [LED-SMD_EVERLIGHT_LKIR30102C-A01XY]  56.2 29.2 270 top
U11  SFH 4253-Z  [OPTO-SMD_L3.2-W2.8-LS3.5-L-1]  5.2 29.2 270 top
U12  SFH 4253-Z  [OPTO-SMD_L3.2-W2.8-LS3.5-L-1]  53.2 29.2 270 top
U13  SFH 4253-Z  [OPTO-SMD_L3.2-W2.8-LS3.5-L-1]  42.2 49.2 150 top
U14  LKIR30102C-A01(XY)  [LED-SMD_EVERLIGHT_LKIR30102C-A01XY]  15.7 5.8 150 top
U15  LKIR30102C-A01(XY)  [LED-SMD_EVERLIGHT_LKIR30102C-A01XY]  42.7 52.6 330 top
USBC1  -  [USB-C_SMD-TYPE-C-31-M-12]  29.2 4 0 top
X1  12MHz  [OSC-SMD_4P-L3.2-W2.5-BL]  20.45 16.2 0 top

## Footprints (pads in the part's own frame, mm; a bottom-side part is the same pattern mirrored in y, then rotated)
C0603
  rect 0.8x0.9 smd: 1(-0.7,0) 2(0.7,0)
LED-SMD_EVERLIGHT_LKIR30102C-A01XY
  rect 1x1.6 smd: 1(1.5,0.2) 2(-1.5,0.2)
  rect 0.9x0.6 smd: 3(0,-0.2)
LED-SMD_L4.0-W1.4-FD_my
  rect 1.6x1.1 smd: 1(-1.85,0) 2(1.85,0)
LED-SMD_L4.0-W1.4-RD_GREEN
  rect 1.6x1.1 smd: 1(-1.85,0) 2(1.85,0)
OPTO-SMD_L3.2-W2.8-LS3.5-L-1
  rect 1.6x2.3 smd: 1(-1.397,0) 2(1.397,0)
OPTO-TH_IRM-56384
  rect 1.5x1.5 hole 0.9: 1(-2.54,0)
  round 1.5 hole 0.9: 2(0,0) 3(2.54,0)
OSC-SMD_4P-L3.2-W2.5-BL
  rect 1.4x1.2 smd: 1(-1.1,-0.875) 2(1.1,-0.875) 3(1.1,0.875) 4(-1.1,0.875)
R0603
  rect 0.806x0.864 smd: 1(-0.753,0) 2(0.753,0)
SOD-123_L2.7-W1.6-LS3.7-RD
  rect 0.91x1.22 smd: 1(-1.635,0) 2(1.635,0)
SOD-523_L1.2-W0.8-LS1.6-BI
  rect 0.6x0.6 smd: 1(-0.75,0) 2(0.75,0)
SOIC-16_L9.9-W3.9-P1.27-LS6.0-BL
  oval 0.602x1.971 smd: 1(-4.445,-2.736) 2(-3.175,-2.736) 3(-1.905,-2.736) 4(-0.635,-2.736) 5(0.635,-2.736) 6(1.905,-2.736) 7(3.175,-2.736) 8(4.445,-2.736) 9(4.445,2.736) 10(3.175,2.736) 11(1.905,2.736) 12(0.635,2.736) 13(-0.635,2.736) 14(-1.905,2.736) 15(-3.175,2.736) 16(-4.445,2.736)
SOT-23-3_L2.9-W1.6-P1.90-LS2.8-BR
  rect 1.07x0.6 smd: 1(1.235,-0.95) 2(1.235,0.95) 3(-1.235,0)
SOT-23-5_L3.0-W1.7-P0.95-LS2.8-BR
  rect 1x0.6 smd: 1(1.3,-0.95) 2(1.3,0) 3(1.3,0.95) 4(-1.3,0.95) 5(-1.3,-0.95)
SOT-363_L2.0-W1.3-P0.65-LS2.1-BR
  rect 0.9x0.4 smd: 1(0.9,-0.65) 2(0.9,0) 3(0.9,0.65) 4(-0.9,0.65) 5(-0.9,0) 6(-0.9,-0.65)
USB-C_SMD-TYPE-C-31-M-12
  oval 1.2x2 hole 0.8x1.6: 0(-4.325,1.716) 0(4.325,1.716)
  oval 1.2x1.8 hole 0.8x1.4: 0(-4.325,-2.484) 0(4.325,-2.484)
  rect 0.3x1.3 smd: A1(-3.35,2.484) A4(-2.55,2.484) A5(-1.25,2.484) A6(-0.25,2.484) A7(0.25,2.484) A8(1.25,2.484) A9(2.55,2.484) A12(3.35,2.484) B1(3.05,2.484) B4(2.25,2.484) B5(1.75,2.484) B6(0.75,2.484) B7(-0.75,2.484) B8(-1.75,2.484) B9(-2.25,2.484) B12(-3.05,2.484)
WIFI-SMD_ESP32-WROOM-32UE
  rect 2x0.9 smd: 1(-8.5,8.755) 2(-8.5,7.485) 3(-8.5,6.215) 4(-8.5,4.945) 5(-8.5,3.675) 6(-8.5,2.405) 7(-8.5,1.135) 8(-8.5,-0.135) 9(-8.5,-1.405) 10(-8.5,-2.675) 11(-8.5,-3.945) 12(-8.5,-5.215) 13(-8.5,-6.485) 14(-8.5,-7.755) 25(8.5,-7.755) 26(8.5,-6.485) 27(8.5,-5.215) 28(8.5,-3.945) 29(8.5,-2.675) 30(8.5,-1.405) 31(8.5,-0.135) 32(8.5,1.135) 33(8.5,2.405) 34(8.5,3.675) 35(8.5,4.945) 36(8.5,6.215) 37(8.5,7.485) 38(8.5,8.755)
  rect 0.9x2 smd: 15(-5.715,-8.755) 16(-4.445,-8.755) 17(-3.175,-8.755) 18(-1.905,-8.755) 19(-0.635,-8.755) 20(0.635,-8.755) 21(1.905,-8.755) 22(3.175,-8.755) 23(4.445,-8.755) 24(5.715,-8.755)
  rect 1.33x1.33 smd: 39(-2.835,3.09) 39(-2.835,1.255) 39(-2.835,-0.58) 39(-1,3.09) 39(-1,1.255) 39(-1,-0.58) 39(0.835,3.09) 39(0.835,1.255) 39(0.835,-0.58)

## Nets
As in the schematic.

Pads without a net: U1 4 5 6 7 8 9 10 11 12 13 14 16 17 18 19 20 21 22 23 24 28 30 31 32 33 36; U2 9 10 11 12 15; U4 3; U5 3; U9 3; U10 3; U14 3; U15 3; USBC1 A8 B8

## Via types
v1: diameter 0.61, hole 0.305, Top Layer to Bottom Layer, 101 vias

## Routing (per net, layer and track width the routed paths; a pad name or vN(x,y) marks a point on that pad's centre or on a via; arc(x,y) is an arc through that point)
GND: length 9.4
  Top Layer w0.254: C11.1 24.71,21.9 U2.1 ; U1.39 U1.39 ; U1.39 U1.39 ; U1.39 U1.39 ; U1.39 U1.39
  vias: v1(7.9,13.95) v1(8.65,13.95) v1(8.7,23.3) v1(9.4,23.3) v1(9.4,13.95) v1(14.7,23.5) v1(15.61,23.5) v1(17.35,39.9) v1(17.3,38.4) v1(17.3,37.4) v1(17.3,36.4) v1(17.3,35.28) v1(18.35,39.9) v1(19.2,22.2) v1(19.35,39.9) v1(20.2,22.2) v1(20.47,39.9) v1(21.11,4.4) v1(21.23,22.2) v1(21.54,39.9) v1(21.58,13.95) v1(21.61,11.9) v1(21.9,4.4) v1(22.33,13.95) v1(22.45,51.05) v1(22.4,11.9) v1(22.54,39.9) v1(23.2,51.05) v1(23.54,39.9) v1(23.7,54.4) v1(23.7,53.6) v1(23.7,52.9) v1(23.7,52.1) v1(23.95,51.05) v1(24.66,39.9) v1(24.7,37.6) v1(24.7,36.6) v1(24.7,35.6) v1(24.7,34.48) v1(25.2,50.55) v1(25.8,11.9) v1(27.7,18) v1(30.95,12) v1(31.7,12) v1(32.01,23.3) v1(34.51,7.6) v1(34.6,24.66) v1(34.7,45.3) v1(35.57,24.66) v1(36.61,12.4) v1(36.61,11.7) v1(37.3,11.7) v1(38.01,21.5) v1(38.3,46.6) v1(38.98,21.5) v1(39.9,40.8) v1(40.62,30.88) v1(40.8,33.89) v1(40.8,32.91) v1(41.61,46.6) v1(41.59,30.88) v1(45.7,40.8) v1(49.3,45.3)
VDD_5V: length 111.4
  Top Layer w0.5: 10.7,16.45 11.33,17.07 U3.3 ; 10.7,16.45 C6.2 D4.1 v1(14.51,13.04) 15.4,12.14 15.4,8.6 16.61,7.4 19.7,7.4 20.51,8.21 U6.2 ; 10.7,16.45 10.7,18.45 11.23,18.97 U3.1 C14.2 12.53,22.17 8.4,26.3 v1(8.4,31.8) ; U5.1 41.01,5.48 41.01,7.24 41.7,7.94 U7.2 38.4,12.59 v1(38.4,12.6) ; U8.2 18.61,51.09 v1(18.61,53.7) 17.08,53.7 U4.1
  Bottom Layer w0.254: v1(14.51,13.04) 14.51,13.1
  Bottom Layer w0.5: v1(8.4,31.8) 8.4,44.8 13.4,49.8 18.2,49.8 19.4,51 19.4,52.9 v1(18.61,53.7) ; v1(38.4,12.6) 37.3,13.7 31.51,13.7 28.11,10.3 17.24,10.3 v1(14.51,13.04)
VDD_ESP32: length 135.9
  Top Layer w0.254: 31.23,21.9 31.3,21.97 31.3,23.6 31.11,23.8 R1.2
  Top Layer w0.5: 24.9,23.2 24.9,23.2 ; 24.9,23.2 27.45,23.2 28.76,21.9 U2.16 C10.2 C9.2 v1(36.15,21.9) 37.2,22.95 37.2,25.45 36.7,25.95 R2.2 ; 24.9,23.2 18.95,23.2 18.2,22.45 15.14,22.45 15.13,22.44 ; 15.13,22.44 13.76,22.44 9.51,26.7 9.51,32.5 6.11,35.9 6.11,41.4 6.89,42.19 R3.1 C1.1 ; 15.13,22.44 U3.5 ; 27.7,45.7 21.7,45.7 18.19,42.19 U1.2 ; 27.7,45.7 R4.1 ; 27.7,45.7 32.45,45.7 34.65,47.9 R5.1
  Top Layer w0.508: U1.2 C1.1 ; LED2.1 22.47,2.37 v1(23.2,3.1) 23.18,3.1 ; LED1.2 39.51,4 v1(39.51,8.3)
  Bottom Layer w0.508: v1(23.2,3.1) 23.61,3.5 34.7,3.5 v1(39.51,8.3) 39.51,11.8 41.2,13.5 41.2,19.4 40.2,20.4 37.06,20.4 36.15,21.31 v1(36.15,21.9)
CC1: length 11.5
  Top Layer w0.254: R6.2 25.11,8 23.61,6.5 23.61,4.7 24.36,3.95 26.95,3.95 27.95,4.95 27.95,6.39
CC2: length 14.7
  Top Layer w0.254: 30.95,6.39 30.95,5.15 29.35,3.54 24.19,3.54 23.2,4.53 23.2,7.29 23.61,7.7 R7.2
DTR: length 13.8
  Top Layer w0.254: 33.45,14.7 34.2,13.95 36.95,13.95 38.2,15.2 R10.2 ; 33.45,14.7 32.7,14.7 32.2,15.2 32.2,17.2 31.32,18.09 30.33,18.09 ; 33.45,14.7 33.8,15.05 Q1.1
ESP_EN: length 49.2
  Top Layer w0.254: Q1.3 35.11,15.3 35.2,15.2 v1(35.7,15.2)
  Top Layer w0.5: C4.1 C3.1 8.64,40.42 8.38,40.68 R3.2
  Top Layer w0.508: v1(16.11,29) 16.11,39.82 15.01,40.92 U1.3 13.59,40.9 12.01,40.9 11.52,40.42 C4.1
  Bottom Layer w0.5: v1(16.11,29) 16.11,28.9 24.61,20.4 24.61,16.9 26.3,15.2 v1(35.7,15.2)
ESP_IO9: length 12.2
  Top Layer w0.254: v1(32.95,18.7) 33.45,18.7 33.8,18.35 Q1.6
  Top Layer w0.5: v1(33.45,24.55) R2.1
  Top Layer w0.508: U1.25 32.46,26.95 R2.1
  Bottom Layer w0.5: v1(33.45,24.55) 32.95,24.05 v1(32.95,18.7)
ESP_RX0: length 2.6
  Top Layer w0.508: R11.1 32.18,38.1 31.9,38.38 U1.34
ESP_TX0: length 2.5
  Top Layer w0.508: U1.35 31.85,39.65 32.05,39.85 R12.1
GPIO_LED_STATUS: length 15
  Top Layer w0.508: U1.37 36.82,42.19 38.4,40.6 38.4,35.8 38.76,35.45 R14.1
RTS: length 9.7
  Top Layer w0.254: Q1.4 35.11,19.05
  Top Layer w0.5: R9.1 36.7,18.7 36.36,19.05 35.11,19.05 35.11,19.3 34.2,20.2 32.7,20.2 31.86,19.36 30.33,19.36
RX_IR: length 25
  Top Layer w0.5: IR1.1 37.99,50.19 37.11,49.3 R5.2 36.16,47.35 v1(36.9,46.6)
  Top Layer w0.508: U1.29 v1(32.51,32.03)
  Bottom Layer w0.508: v1(32.51,32.03) 32.53,32.03 33.11,32.6 33.11,39.1 36.9,42.9 v1(36.9,46.6)
SHIELD: length 6.8
  Top Layer w0.508: USBC1.0 34.32,5.72 35.2,6.6 C7.2 C8.1 R8.1
TX_IR: length 12.4
  Top Layer w0.5: 40.25,26.7 39.01,26.7 37.49,28.22 U1.26 ; 40.25,26.7 R22.1 ; 40.25,26.7 R23.1
USBDN: length 14.9
  Top Layer w0.297: 28.45,6.39 28.45,7.18 28.48,7.21 28.48,11.54 27.7,12.32 27.7,15.2 26.95,15.96 25.86,15.96 25.45,15.55 U2.6 ; 29.45,5.89 29.45,5.47 29.2,5.22 28.7,5.22 28.45,5.47 28.45,6.14
USBDP: length 15.3
  Top Layer w0.297: 28.93,7.5 29.66,7.5 29.95,7.21 29.95,6.39 ; 28.93,7.5 28.93,11.73 28.15,12.5 28.15,15.39 27.14,16.41 25.9,16.41 25.49,16.82 U2.5 ; 28.93,7.5 28.93,7.21 28.95,7.18 28.95,6.39
VUSB: length 36.8
  Top Layer w0.254: 32.12,9.37 32.45,9.7 32.45,10.2 ; 32.12,9.37 31.87,9.37 31.45,8.95 31.45,6.39 ; 32.12,9.37 31.76,9 31.76,6.39 ; 26.65,6.39 v1(26.65,9.15) 26.7,9.2 26.95,8.95 26.95,6.39
  Top Layer w0.5: D4.2 12.95,8.55 13.4,8.1 v1(14.01,8.1) ; v1(32.45,11.45) 32.45,10.2
  Bottom Layer w0.5: v1(32.45,11.45) 30.15,9.15 v1(26.65,9.15) 15.05,9.15 v1(14.01,8.1)
X0: length 9.4
  Top Layer w0.5: C13.2 X1.1 19.36,14.12 20.47,13.01 U2.8
X1: length 8.1
  Top Layer w0.5: C12.2 21.2,18.95 21.7,18.45 21.7,17.23 X1.3 22.58,17.08 23.2,16.45 23.2,14.95 23.88,14.28 U2.7
$1N8418: length 5.2
  Top Layer w0.254: Q1.2 34.45,14.7 34.7,14.45 36.2,14.45 36.7,14.95 R9.2
$1N8579: length 9.9
  Top Layer w0.254: v1(33.95,19.2) 34.45,18.7 Q1.5
  Top Layer w0.5: v1(39.7,19.2) 39.7,18.45 38.96,17.7 R10.1
  Bottom Layer w0.5: v1(33.95,19.2) v1(39.7,19.2)
$1N9802: length 2.9
  Top Layer w0.5: U3.4 15.13,15.63 14.7,15.2 C15.1
$1N16651: length 7.2
  Top Layer w0.254: U1.27 29.24,29.49 28.95,29.2 R1.1
$1N25941: length 4
  Top Layer w0.5: C11.2 22.7,18.8 23.42,18.09 U2.4
$1N27717: length 6
  Top Layer w0.5: IR1.3 31.12,49.9 C5.1 27.7,49.9
$1N35621: length 24.8
  Top Layer w0.5: U2.2 26.13,20.63 v1(26.95,21.45)
  Top Layer w0.508: R11.2 v1(36.01,38.1)
  Bottom Layer w0.5: v1(36.01,38.1) 36.51,37.6 36.51,31 v1(26.95,21.45)
$1N35623: length 29.5
  Top Layer w0.5: U2.3 26.61,19.36 v1(27.2,19.95)
  Top Layer w0.508: v1(36.01,39.85) R12.2
  Bottom Layer w0.5: v1(27.2,19.95) 37.8,30.55 37.8,38.6 36.55,39.85 v1(36.01,39.85)
$1N37592: length 3.6
  Top Layer w0.5: Q4.1 R23.2 R25.2
$1N42833: length 3.6
  Top Layer w0.5: R22.2 R24.2 Q3.1
$1N46226: length 6.2
  Top Layer w0.5: Q4.3 R21.1 R20.1
$1N46382: length 8.9
  Top Layer w0.5: Q3.3 47.01,28.7 48.25,29.95 R18.1 R19.1
$1N46407: length 37.4
  Top Layer w0.5: R21.2 v1(42.8,20.9) ; v1(40.11,53.9) 41.13,53.9 U15.2
  Bottom Layer w0.5: v1(42.8,20.9) 42.8,49.9 40.01,52.7 40.01,53.8 v1(40.11,53.9)
$1N46409: length 26.8
  Top Layer w0.5: v1(48.31,9.29) arc(46.4,7.61) 44.34,6.12 ; v1(56.4,26.5) U10.1
  Bottom Layer w0.5: v1(56.4,26.5) 48.31,18.41 v1(48.31,9.29)
$1N46420: length 27.8
  Top Layer w0.5: 14.31,6.39 arc(12.84,7.42) v1(11.45,8.54) ; v1(2,25.8) U9.2
  Bottom Layer w0.5: v1(11.45,8.54) 11.45,17.06 7.11,21.4 5.2,21.4 2,24.6 v1(2,25.8)
$1N46422: length 35.4
  Top Layer w0.5: v1(33.2,8) 34.9,9.7 34.9,12.2 35.9,13.2 37.4,13.2 42.7,18.5 R20.2 ; U14.2 17.2,5.18 v1(17.2,6.4)
  Bottom Layer w0.5: v1(33.2,8) 18.8,8 v1(17.2,6.4)
$1N61932: length 22.8
  Top Layer w0.5: v1(16.61,13.5) 17.2,12.9 17.2,11.19 U6.1 ; v1(5.2,25.5) U11.2
  Bottom Layer w0.5: v1(5.2,25.5) 5.2,24.9 v1(16.61,13.5)
$1N62062: length 20.9
  Top Layer w0.5: U7.1 47.7,14.29 47.7,19.6 53.2,25.1 U12.2
$1N62136: length 28.7
  Top Layer w0.254: v1(38.3,47.9) 39.7,47.9 40.4,48.6 40.4,49.31 U13.2
  Top Layer w0.5: U8.1 14.99,47.51 15.3,47.2 v1(18.8,47.2)
  Bottom Layer w0.5: v1(38.3,47.9) 19.5,47.9 18.8,47.2
$1N62310: length 3.4
  Top Layer w0.5: U12.1 53.2,30.6 R18.2
$1N62317: length 13
  Top Layer w0.5: R19.2 48.25,43.67 U13.1
$1N64118: length 42.8
  Top Layer w0.5: U11.1 5.31,30.7 v1(7.51,30.7) ; v1(34.01,30.7) 38.2,30.7 39.2,31.7 44.3,31.7 46.2,33.6 R17.2
  Bottom Layer w0.5: v1(34.01,30.7) v1(7.51,30.7)
$1N66097: length 3.2
  Top Layer w0.508: R14.2 R15.2 42.31,36.95 42.51,37.15 Q2.1
$1N66164: length 2.2
  Top Layer w0.508: R16.2 18.97,5.32 LED2.2
$1N66203: length 36.5
  Top Layer w0.508: v1(38.4,4.8) R13.1 ; Q2.3 46.3,36.2 v1(46.61,35.9)
  Bottom Layer w0.508: v1(46.61,35.9) 46.61,13.9 42.4,9.7 42.4,8.8 v1(38.4,4.8)
$1N66205: length 2.6
  Top Layer w0.508: LED1.1 35.67,4.48 R13.2
$1N46399: length 25.9
  Top Layer w0.5: 44.29,52.31 arc(53.1,43.01) 56.76,30.73
$1N46424: length 25.6
  Top Layer w0.5: 1.98,30.69 arc(5.59,42.83) 14.29,52.02

## Copper pours and planes (outline as drawn; the poured copper is in the pictures)
GND on Top Layer: outline of 184 points within -1.62,-3.73 64.23,62.13
GND on Bottom Layer: outline of 184 points within -3.72,-3.73 62.13,62.13

## Text on the board
Bottom Silkscreen Layer: Firmware / by Tasmota | DEVELOPED BY ROBONOMICS COMMUNITY | IR REMOTE
Top Silkscreen Layer: ESP32-WROOM-32UE-N8 | IR-ESP32-06-24
